# EAGLE schematic Re.Cycle (EAGLE 5.11)

## Sheet 1 of 4
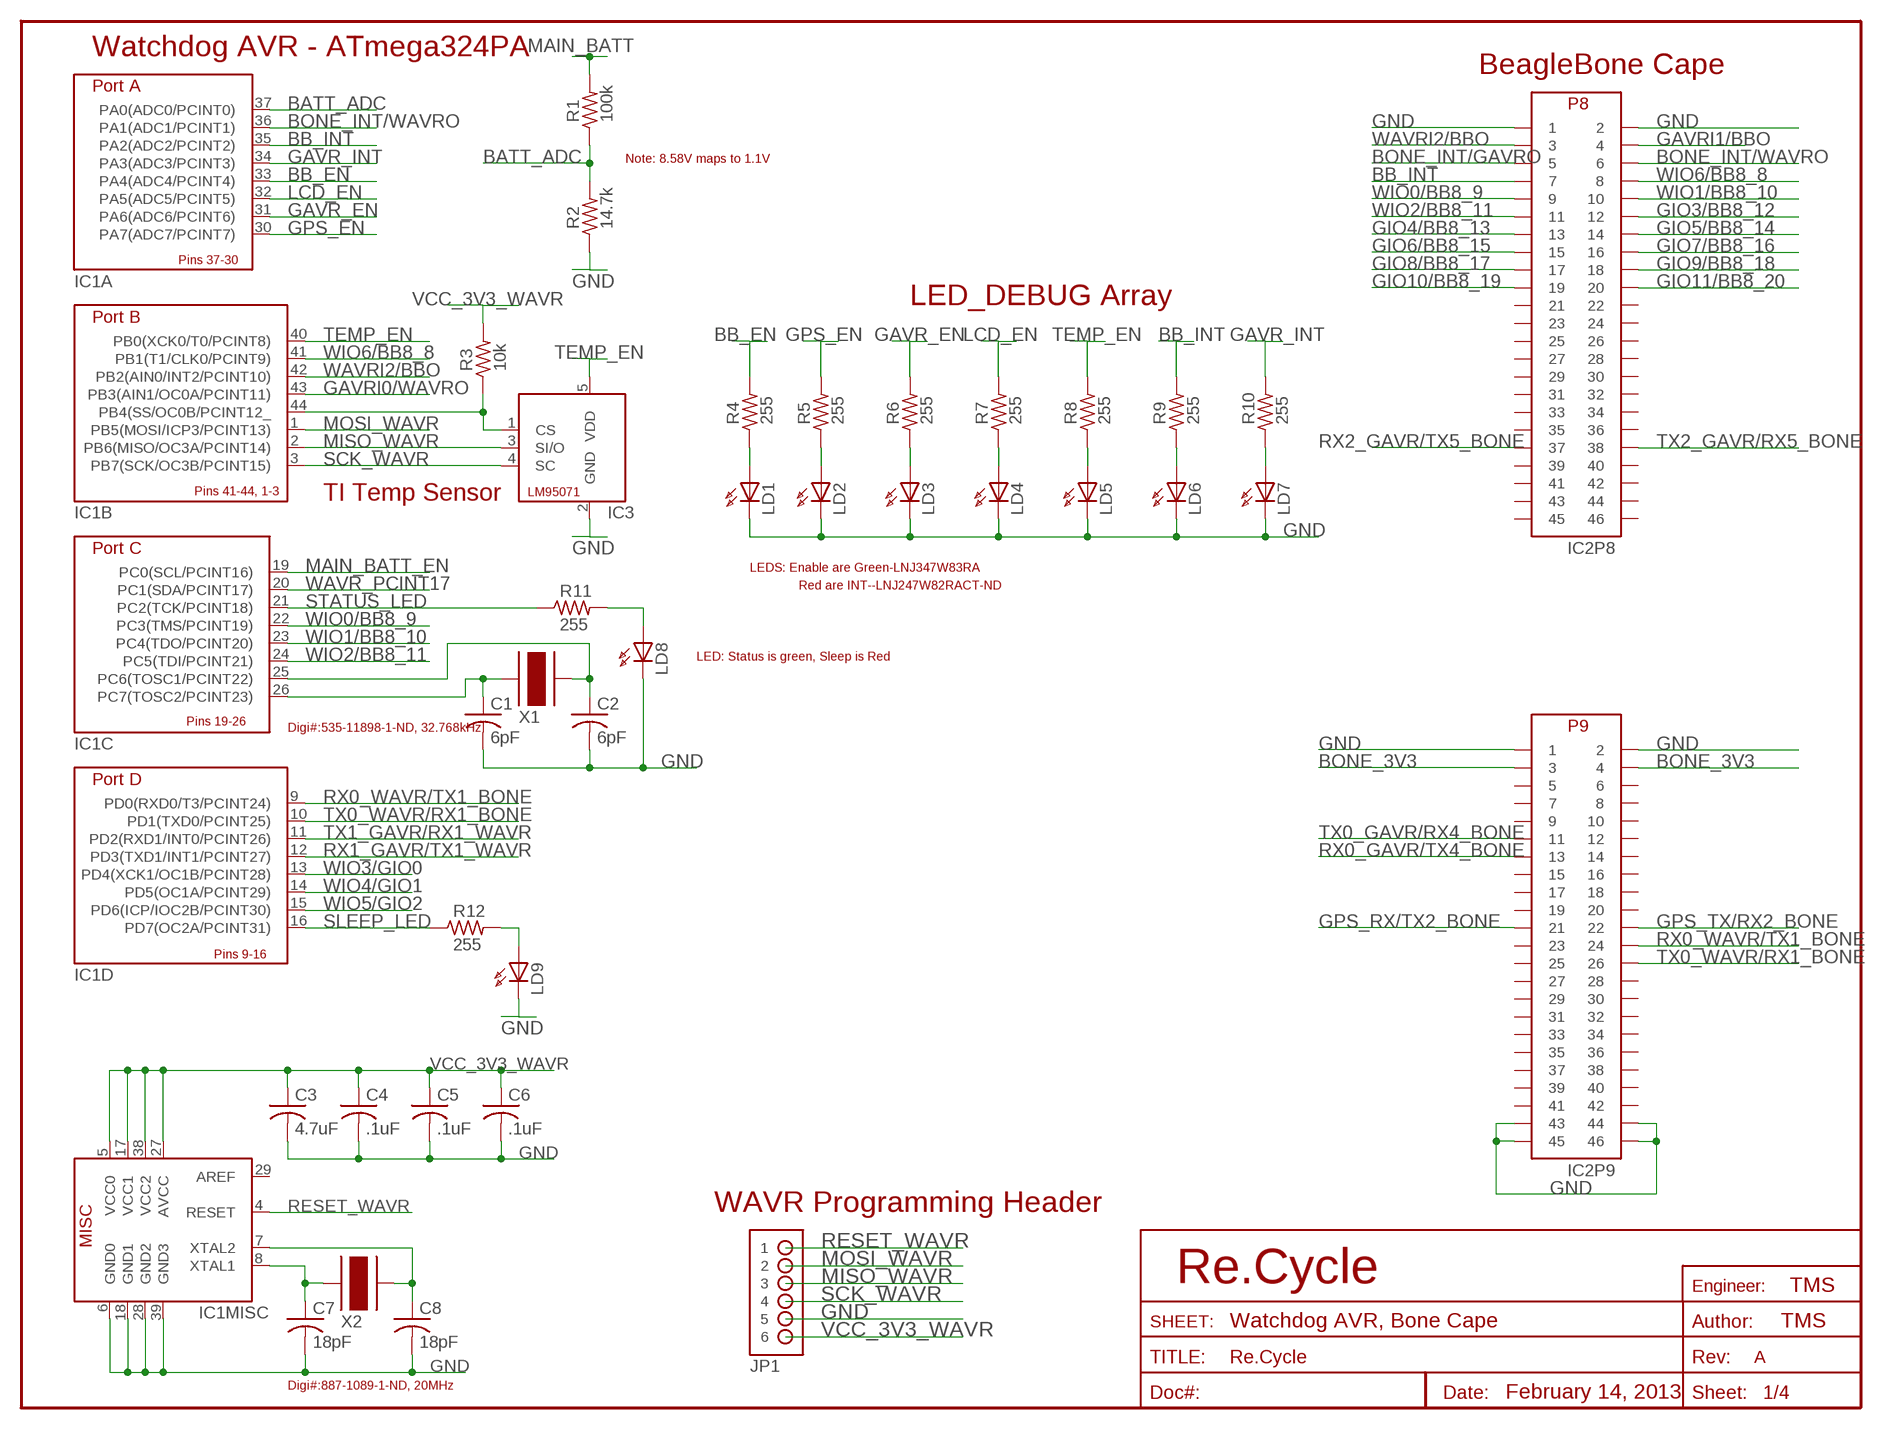
[diagram p0: schematic, sheet 1]

### Parts
C1  6pF  CAP-S0603  [C0603]
C2  6pF  CAP-S0603  [C0603]
C3  4.7uF  CAP-S0603  [C0603]
C4  .1uF  CAP-S0603  [C0603]
C5  .1uF  CAP-S0603  [C0603]
C6  .1uF  CAP-S0603  [C0603]
C7  18pF  CAP-S0603  [C0603]
C8  18pF  CAP-S0603  [C0603]
IC1  ATMEGA1284P-AU  [TQFP44]
IC2  BEAGLE_BONE_CAPE-HEADER_ONLY  [BEAGLE_BONE_CAPE]
IC3  LM95071  [SOT23-5]
JP1  HDR-1X6-OFFSET  [HDR-1X6_OFFSET]
LD1  LED-S0402  [D0402]
LD2  LED-S0402  [D0402]
LD3  LED-S0402  [D0402]
LD4  LED-S0402  [D0402]
LD5  LED-S0402  [D0402]
LD6  LED-S0402  [D0402]
LD7  LED-S0402  [D0402]
LD8  LED-S0402  [D0402]
LD9  LED-S0402  [D0402]
R1  100k  RES-S0603  [R0603]
R2  14.7k  RES-S0603  [R0603]
R3  10k  RES-S0603  [R0603]
R4  255  RES-S0603  [R0603]
R5  255  RES-S0603  [R0603]
R6  255  RES-S0603  [R0603]
R7  255  RES-S0603  [R0603]
R8  255  RES-S0603  [R0603]
R9  255  RES-S0603  [R0603]
R10  255  RES-S0603  [R0603]
R11  255  RES-S0603  [R0603]
R12  255  RES-S0603  [R0603]
X1  XTAL-ABS07  [ABS07]
X2  XTAL-TXC-7A  [TXC-7A-SERIES]

### Nets
BATT_ADC: IC1.37(A:PA0(ADC0/PCINT0)) R1.1 R2.2
BB_EN: IC1.33(A:PA4(ADC4/PCINT4)) R4.2 ; also sheet 3
BB_INT: IC1.35(A:PA2(ADC2/PCINT2)) IC2.P8_7 R9.2
BONE_3V3: IC2.P9_3 IC2.P9_4 ; also sheet 3
BONE_INT/GAVRO: IC2.P8_5 ; also sheet 2
BONE_INT/WAVRO: IC1.36(A:PA1(ADC1/PCINT1)) IC2.P8_6
GAVR_EN: IC1.31(A:PA6(ADC6/PCINT6)) R6.2 ; also sheet 3
GAVR_INT: IC1.34(A:PA3(ADC3/PCINT3)) R10.2 ; also sheet 2
GAVRI0/WAVRO: IC1.43(B:PB3(AIN1/OC0A/PCINT11)) ; also sheet 2
GAVRI1/BBO: IC2.P8_4 ; also sheet 2
GIO3/BB8_12: IC2.P8_12 ; also sheet 2
GIO4/BB8_13: IC2.P8_13 ; also sheet 2
GIO5/BB8_14: IC2.P8_14 ; also sheet 2
GIO6/BB8_15: IC2.P8_15 ; also sheet 2
GIO7/BB8_16: IC2.P8_16 ; also sheet 2
GIO8/BB8_17: IC2.P8_17 ; also sheet 2
GIO9/BB8_18: IC2.P8_18 ; also sheet 2
GIO10/BB8_19: IC2.P8_19 ; also sheet 2
GIO11/BB8_20: IC2.P8_20 ; also sheet 2
GND: C1.2 C2.2 C3.2 C4.2 C5.2 C6.2 C7.2 C8.2 IC1.6(MISC:GND0) IC1.18(MISC:GND1) IC1.28(MISC:GND2) IC1.39(MISC:GND3) IC2.P8_1 IC2.P8_2 IC2.P9_1 IC2.P9_2 IC2.P9_43 IC2.P9_44 IC2.P9_45 IC2.P9_46 IC3.2(GND) JP1.5 LD1.C LD2.C LD3.C LD4.C LD5.C LD6.C LD7.C LD8.C LD9.C R2.1 ; also sheet 2,3,4
GPS_EN: IC1.30(A:PA7(ADC7/PCINT7)) R5.2 ; also sheet 3
GPS_RX/TX2_BONE: IC2.P9_21 ; also sheet 2,3
GPS_TX/RX2_BONE: IC2.P9_22 ; also sheet 2,3
LCD_EN: IC1.32(A:PA5(ADC5/PCINT5)) R7.2 ; also sheet 3
MAIN_BATT: R1.2 ; also sheet 3,4
MAIN_BATT_EN: IC1.19(C:PC0(SCL/PCINT16)) ; also sheet 3
MISO_WAVR: IC1.2(B:PB6(MISO/OC3A/PCINT14)) IC3.3(SI/O) JP1.3
MOSI_WAVR: IC1.1(B:PB5(MOSI/ICP3/PCINT13)) JP1.2
N$1: C2.1 IC1.25(C:PC6(TOSC1/PCINT22)) X1.2
N$2: C8.1 IC1.7(MISC:XTAL2) X2.P$2
N$3: C7.1 IC1.8(MISC:XTAL1) X2.P$1
N$4: IC1.44(B:PB4(SS/OC0B/PCINT12_) IC3.1(CS) R3.1
N$6: LD8.A R11.2
N$8: LD9.A R12.2
N$11: LD1.A R4.1
N$12: LD5.A R8.1
N$13: LD6.A R9.1
N$15: LD7.A R10.1
N$16: LD2.A R5.1
N$17: LD3.A R6.1
N$18: LD4.A R7.1
N$19: C1.1 IC1.26(C:PC7(TOSC2/PCINT23)) X1.1
RESET_WAVR: IC1.4(MISC:RESET) JP1.1
RX0_GAVR/TX4_BONE: IC2.P9_13 ; also sheet 2
RX0_WAVR/TX1_BONE: IC1.9(D:PD0(RXD0/T3/PCINT24)) IC2.P9_24
RX1_GAVR/TX1_WAVR: IC1.12(D:PD3(TXD1/INT1/PCINT27)) ; also sheet 2
RX2_GAVR/TX5_BONE: IC2.P8_37 ; also sheet 2
SCK_WAVR: IC1.3(B:PB7(SCK/OC3B/PCINT15)) IC3.4(SC) JP1.4
SLEEP_LED: IC1.16(D:PD7(OC2A/PCINT31)) R12.1
STATUS_LED: IC1.21(C:PC2(TCK/PCINT18)) R11.1
TEMP_EN: IC1.40(B:PB0(XCK0/T0/PCINT8)) IC3.5(VDD) R8.2
TX0_GAVR/RX4_BONE: IC2.P9_11 ; also sheet 2
TX0_WAVR/RX1_BONE: IC1.10(D:PD1(TXD0/PCINT25)) IC2.P9_26
TX1_GAVR/RX1_WAVR: IC1.11(D:PD2(RXD1/INT0/PCINT26)) ; also sheet 2
TX2_GAVR/RX5_BONE: IC2.P8_38 ; also sheet 2
VCC_3V3_WAVR: C3.1 C4.1 C5.1 C6.1 IC1.5(MISC:VCC0) IC1.17(MISC:VCC1) IC1.27(MISC:AVCC) IC1.38(MISC:VCC2) JP1.6 R3.2 ; also sheet 3
WAVR_PCINT17: IC1.20(C:PC1(SDA/PCINT17)) ; also sheet 2
WAVRI2/BBO: IC1.42(B:PB2(AIN0/INT2/PCINT10)) IC2.P8_3
WIO0/BB8_9: IC1.22(C:PC3(TMS/PCINT19)) IC2.P8_9
WIO1/BB8_10: IC1.23(C:PC4(TDO/PCINT20)) IC2.P8_10
WIO2/BB8_11: IC1.24(C:PC5(TDI/PCINT21)) IC2.P8_11
WIO3/GIO0: IC1.13(D:PD4(XCK1/OC1B/PCINT28)) ; also sheet 2
WIO4/GIO1: IC1.14(D:PD5(OC1A/PCINT29)) ; also sheet 2
WIO5/GIO2: IC1.15(D:PD6(ICP/IOC2B/PCINT30)) ; also sheet 2
WIO6/BB8_8: IC1.41(B:PB1(T1/CLK0/PCINT9)) IC2.P8_8
Unconnected: IC1.29(MISC:AREF) IC2.P8_21 IC2.P8_22 IC2.P8_23 IC2.P8_24 IC2.P8_25 IC2.P8_26 IC2.P8_27 IC2.P8_28 IC2.P8_29 IC2.P8_30 IC2.P8_31 IC2.P8_32 IC2.P8_33 IC2.P8_34 IC2.P8_35 IC2.P8_36 IC2.P8_39 IC2.P8_40 IC2.P8_41 IC2.P8_42 IC2.P8_43 IC2.P8_44 IC2.P8_45 IC2.P8_46 IC2.P9_5 IC2.P9_6 IC2.P9_7 IC2.P9_8 IC2.P9_9 IC2.P9_10 IC2.P9_12 IC2.P9_14 IC2.P9_15 IC2.P9_16 IC2.P9_17 IC2.P9_18 IC2.P9_19 IC2.P9_20 IC2.P9_23 IC2.P9_25 IC2.P9_27 IC2.P9_28 IC2.P9_29 IC2.P9_30 IC2.P9_31 IC2.P9_32 IC2.P9_33 IC2.P9_34 IC2.P9_35 IC2.P9_36 IC2.P9_37 IC2.P9_38 IC2.P9_39 IC2.P9_40 IC2.P9_41 IC2.P9_42

### Notes on the sheet
- Watchdog AVR - ATmega324PA
- BeagleBone Cape
- Note: 8.58V maps to 1.1V
- LED_DEBUG Array
- TI Temp Sensor
- LEDS: Enable are Green-LNJ347W83RA
- Red are INT--LNJ247W82RACT-ND
- LED: Status is green, Sleep is Red
- Digi#:535-11898-1-ND, 32.768kHz
- WAVR Programming Header
- Re.Cycle
- TMS
- Watchdog AVR, Bone Cape | TMS
- A
- Digi#:887-1089-1-ND, 20MHz
- February 14, 2013

## Sheet 2 of 4
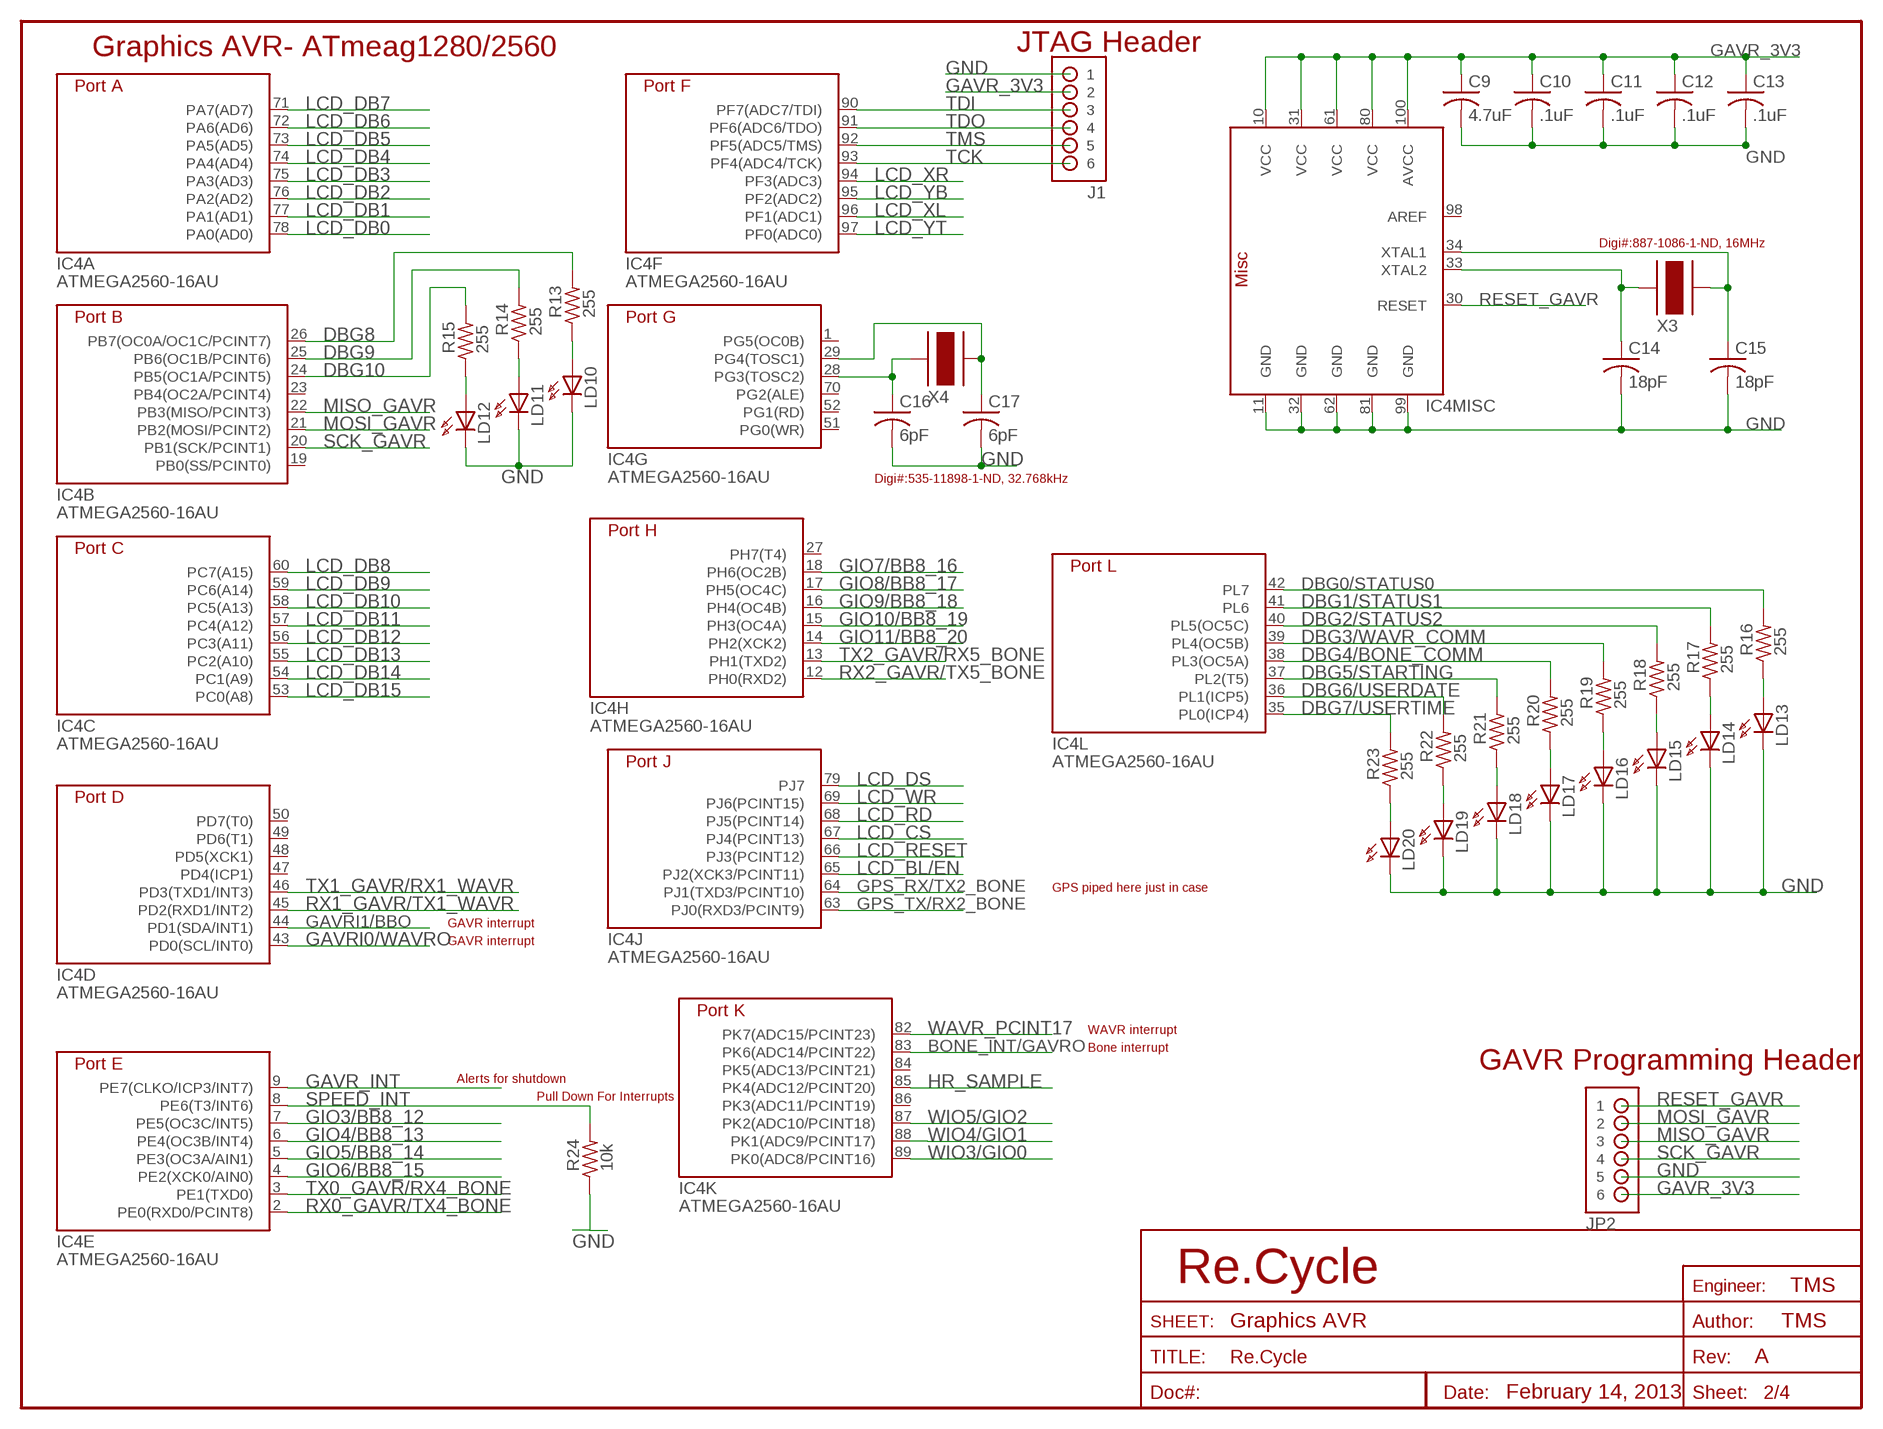
[diagram p1: schematic, sheet 2]

### Parts
C9  4.7uF  CAP-S0603  [C0603]
C10  .1uF  CAP-S0603  [C0603]
C11  .1uF  CAP-S0603  [C0603]
C12  .1uF  CAP-S0603  [C0603]
C13  .1uF  CAP-S0603  [C0603]
C14  18pF  CAP-S0603  [C0603]
C15  18pF  CAP-S0603  [C0603]
C16  6pF  CAP-S0603  [C0603]
C17  6pF  CAP-S0603  [C0603]
IC4  ATMEGA2560-16AU  [TQFP100-100A]
J1  HDR-1X6  [HDR-1X6]
JP2  HDR-1X6-OFFSET  [HDR-1X6_OFFSET]
LD10  LED-S0402  [D0402]
LD11  LED-S0402  [D0402]
LD12  LED-S0402  [D0402]
LD13  LED-S0402  [D0402]
LD14  LED-S0402  [D0402]
LD15  LED-S0402  [D0402]
LD16  LED-S0402  [D0402]
LD17  LED-S0402  [D0402]
LD18  LED-S0402  [D0402]
LD19  LED-S0402  [D0402]
LD20  LED-S0402  [D0402]
R13  255  RES-S0603  [R0603]
R14  255  RES-S0603  [R0603]
R15  255  RES-S0603  [R0603]
R16  255  RES-S0603  [R0603]
R17  255  RES-S0603  [R0603]
R18  255  RES-S0603  [R0603]
R19  255  RES-S0603  [R0603]
R20  255  RES-S0603  [R0603]
R21  255  RES-S0603  [R0603]
R22  255  RES-S0603  [R0603]
R23  255  RES-S0603  [R0603]
R24  10k  RES-S0603  [R0603]
X3  XTAL-TXC-7A  [TXC-7A-SERIES]
X4  XTAL-ABS07  [ABS07]

### Nets
BONE_INT/GAVRO: IC4.83(K:PK6(ADC14/PCINT22)) ; also sheet 1
DBG0/STATUS0: IC4.42(L:PL7) R16.2
DBG1/STATUS1: IC4.41(L:PL6) R17.2
DBG2/STATUS2: IC4.40(L:PL5(OC5C)) R18.2
DBG3/WAVR_COMM: IC4.39(L:PL4(OC5B)) R19.2
DBG4/BONE_COMM: IC4.38(L:PL3(OC5A)) R20.2
DBG5/STARTING: IC4.37(L:PL2(T5)) R21.2
DBG6/USERDATE: IC4.36(L:PL1(ICP5)) R22.2
DBG7/USERTIME: IC4.35(L:PL0(ICP4)) R23.2
DBG8: IC4.26(B:PB7(OC0A/OC1C/PCINT7)) R13.2
DBG9: IC4.25(B:PB6(OC1B/PCINT6)) R14.2
DBG10: IC4.24(B:PB5(OC1A/PCINT5)) R15.2
GAVR_3V3: C9.1 C10.1 C11.1 C12.1 C13.1 IC4.10(MISC:VCC) IC4.31(MISC:VCC) IC4.61(MISC:VCC) IC4.80(MISC:VCC) IC4.100(MISC:AVCC) J1.2 JP2.6 ; also sheet 3
GAVR_INT: IC4.9(E:PE7(CLKO/ICP3/INT7)) ; also sheet 1
GAVRI0/WAVRO: IC4.43(D:PD0(SCL/INT0)) ; also sheet 1
GAVRI1/BBO: IC4.44(D:PD1(SDA/INT1)) ; also sheet 1
GIO3/BB8_12: IC4.7(E:PE5(OC3C/INT5)) ; also sheet 1
GIO4/BB8_13: IC4.6(E:PE4(OC3B/INT4)) ; also sheet 1
GIO5/BB8_14: IC4.5(E:PE3(OC3A/AIN1)) ; also sheet 1
GIO6/BB8_15: IC4.4(E:PE2(XCK0/AIN0)) ; also sheet 1
GIO7/BB8_16: IC4.18(H:PH6(OC2B)) ; also sheet 1
GIO8/BB8_17: IC4.17(H:PH5(OC4C)) ; also sheet 1
GIO9/BB8_18: IC4.16(H:PH4(OC4B)) ; also sheet 1
GIO10/BB8_19: IC4.15(H:PH3(OC4A)) ; also sheet 1
GIO11/BB8_20: IC4.14(H:PH2(XCK2)) ; also sheet 1
GND: C9.2 C10.2 C11.2 C12.2 C13.2 C14.2 C15.2 C16.2 C17.2 IC4.11(MISC:GND) IC4.32(MISC:GND) IC4.62(MISC:GND) IC4.81(MISC:GND) IC4.99(MISC:GND) J1.1 JP2.5 LD10.C LD11.C LD12.C LD13.C LD14.C LD15.C LD16.C LD17.C LD18.C LD19.C LD20.C R24.1 ; also sheet 1,3,4
GPS_RX/TX2_BONE: IC4.64(J:PJ1(TXD3/PCINT10)) ; also sheet 1,3
GPS_TX/RX2_BONE: IC4.63(J:PJ0(RXD3/PCINT9)) ; also sheet 1,3
HR_SAMPLE: IC4.85(K:PK4(ADC12/PCINT20)) ; also sheet 3
LCD_BL/EN: IC4.65(J:PJ2(XCK3/PCINT11)) ; also sheet 3
LCD_CS: IC4.67(J:PJ4(PCINT13)) ; also sheet 3
LCD_DB0: IC4.78(A:PA0(AD0)) ; also sheet 3
LCD_DB1: IC4.77(A:PA1(AD1)) ; also sheet 3
LCD_DB2: IC4.76(A:PA2(AD2)) ; also sheet 3
LCD_DB3: IC4.75(A:PA3(AD3)) ; also sheet 3
LCD_DB4: IC4.74(A:PA4(AD4)) ; also sheet 3
LCD_DB5: IC4.73(A:PA5(AD5)) ; also sheet 3
LCD_DB6: IC4.72(A:PA6(AD6)) ; also sheet 3
LCD_DB7: IC4.71(A:PA7(AD7)) ; also sheet 3
LCD_DB8: IC4.60(C:PC7(A15)) ; also sheet 3
LCD_DB9: IC4.59(C:PC6(A14)) ; also sheet 3
LCD_DB10: IC4.58(C:PC5(A13)) ; also sheet 3
LCD_DB11: IC4.57(C:PC4(A12)) ; also sheet 3
LCD_DB12: IC4.56(C:PC3(A11)) ; also sheet 3
LCD_DB13: IC4.55(C:PC2(A10)) ; also sheet 3
LCD_DB14: IC4.54(C:PC1(A9)) ; also sheet 3
LCD_DB15: IC4.53(C:PC0(A8)) ; also sheet 3
LCD_DS: IC4.79(J:PJ7) ; also sheet 3
LCD_RD: IC4.68(J:PJ5(PCINT14)) ; also sheet 3
LCD_RESET: IC4.66(J:PJ3(PCINT12)) ; also sheet 3
LCD_WR: IC4.69(J:PJ6(PCINT15)) ; also sheet 3
LCD_XL: IC4.96(F:PF1(ADC1)) ; also sheet 3
LCD_XR: IC4.94(F:PF3(ADC3)) ; also sheet 3
LCD_YB: IC4.95(F:PF2(ADC2)) ; also sheet 3
LCD_YT: IC4.97(F:PF0(ADC0)) ; also sheet 3
MISO_GAVR: IC4.22(B:PB3(MISO/PCINT3)) JP2.3
MOSI_GAVR: IC4.21(B:PB2(MOSI/PCINT2)) JP2.2
N$5: C16.1 IC4.28(G:PG3(TOSC2)) X4.1
N$10: C17.1 IC4.29(G:PG4(TOSC1)) X4.2
N$21: C15.1 IC4.34(MISC:XTAL1) X3.P$2
N$22: C14.1 IC4.33(MISC:XTAL2) X3.P$1
N$24: LD14.A R17.1
N$25: LD13.A R16.1
N$26: LD15.A R18.1
N$27: LD10.A R13.1
N$28: LD20.A R23.1
N$29: LD19.A R22.1
N$30: LD18.A R21.1
N$31: LD17.A R20.1
N$32: LD16.A R19.1
N$37: LD12.A R15.1
N$38: LD11.A R14.1
RESET_GAVR: IC4.30(MISC:RESET) JP2.1
RX0_GAVR/TX4_BONE: IC4.2(E:PE0(RXD0/PCINT8)) ; also sheet 1
RX1_GAVR/TX1_WAVR: IC4.45(D:PD2(RXD1/INT2)) ; also sheet 1
RX2_GAVR/TX5_BONE: IC4.12(H:PH0(RXD2)) ; also sheet 1
SCK_GAVR: IC4.20(B:PB1(SCK/PCINT1)) JP2.4
SPEED_INT: IC4.8(E:PE6(T3/INT6)) R24.2 ; also sheet 3
TCK: IC4.93(F:PF4(ADC4/TCK)) J1.6
TDI: IC4.90(F:PF7(ADC7/TDI)) J1.3
TDO: IC4.91(F:PF6(ADC6/TDO)) J1.4
TMS: IC4.92(F:PF5(ADC5/TMS)) J1.5
TX0_GAVR/RX4_BONE: IC4.3(E:PE1(TXD0)) ; also sheet 1
TX1_GAVR/RX1_WAVR: IC4.46(D:PD3(TXD1/INT3)) ; also sheet 1
TX2_GAVR/RX5_BONE: IC4.13(H:PH1(TXD2)) ; also sheet 1
WAVR_PCINT17: IC4.82(K:PK7(ADC15/PCINT23)) ; also sheet 1
WIO3/GIO0: IC4.89(K:PK0(ADC8/PCINT16)) ; also sheet 1
WIO4/GIO1: IC4.88(K:PK1(ADC9/PCINT17)) ; also sheet 1
WIO5/GIO2: IC4.87(K:PK2(ADC10/PCINT18)) ; also sheet 1
Unconnected: IC4.1(G:PG5(OC0B)) IC4.19(B:PB0(SS/PCINT0)) IC4.23(B:PB4(OC2A/PCINT4)) IC4.27(H:PH7(T4)) IC4.47(D:PD4(ICP1)) IC4.48(D:PD5(XCK1)) IC4.49(D:PD6(T1)) IC4.50(D:PD7(T0)) IC4.51(G:PG0(WR)) IC4.52(G:PG1(RD)) IC4.70(G:PG2(ALE)) IC4.84(K:PK5(ADC13/PCINT21)) IC4.86(K:PK3(ADC11/PCINT19)) IC4.98(MISC:AREF)

### Notes on the sheet
- Graphics AVR- ATmeag1280/2560 | JTAG Header
- Digi#:887-1086-1-ND, 16MHz
- Digi#:535-11898-1-ND, 32.768kHz
- GPS piped here just in case
- GAVR interrupt
- GAVR interrupt
- WAVR interrupt
- Bone interrupt
- GAVR Programming Header
- Alerts for shutdown
- Pull Down For Interrupts
- Re.Cycle
- TMS
- Graphics AVR | TMS
- A
- February 14, 2013

## Sheet 3 of 4
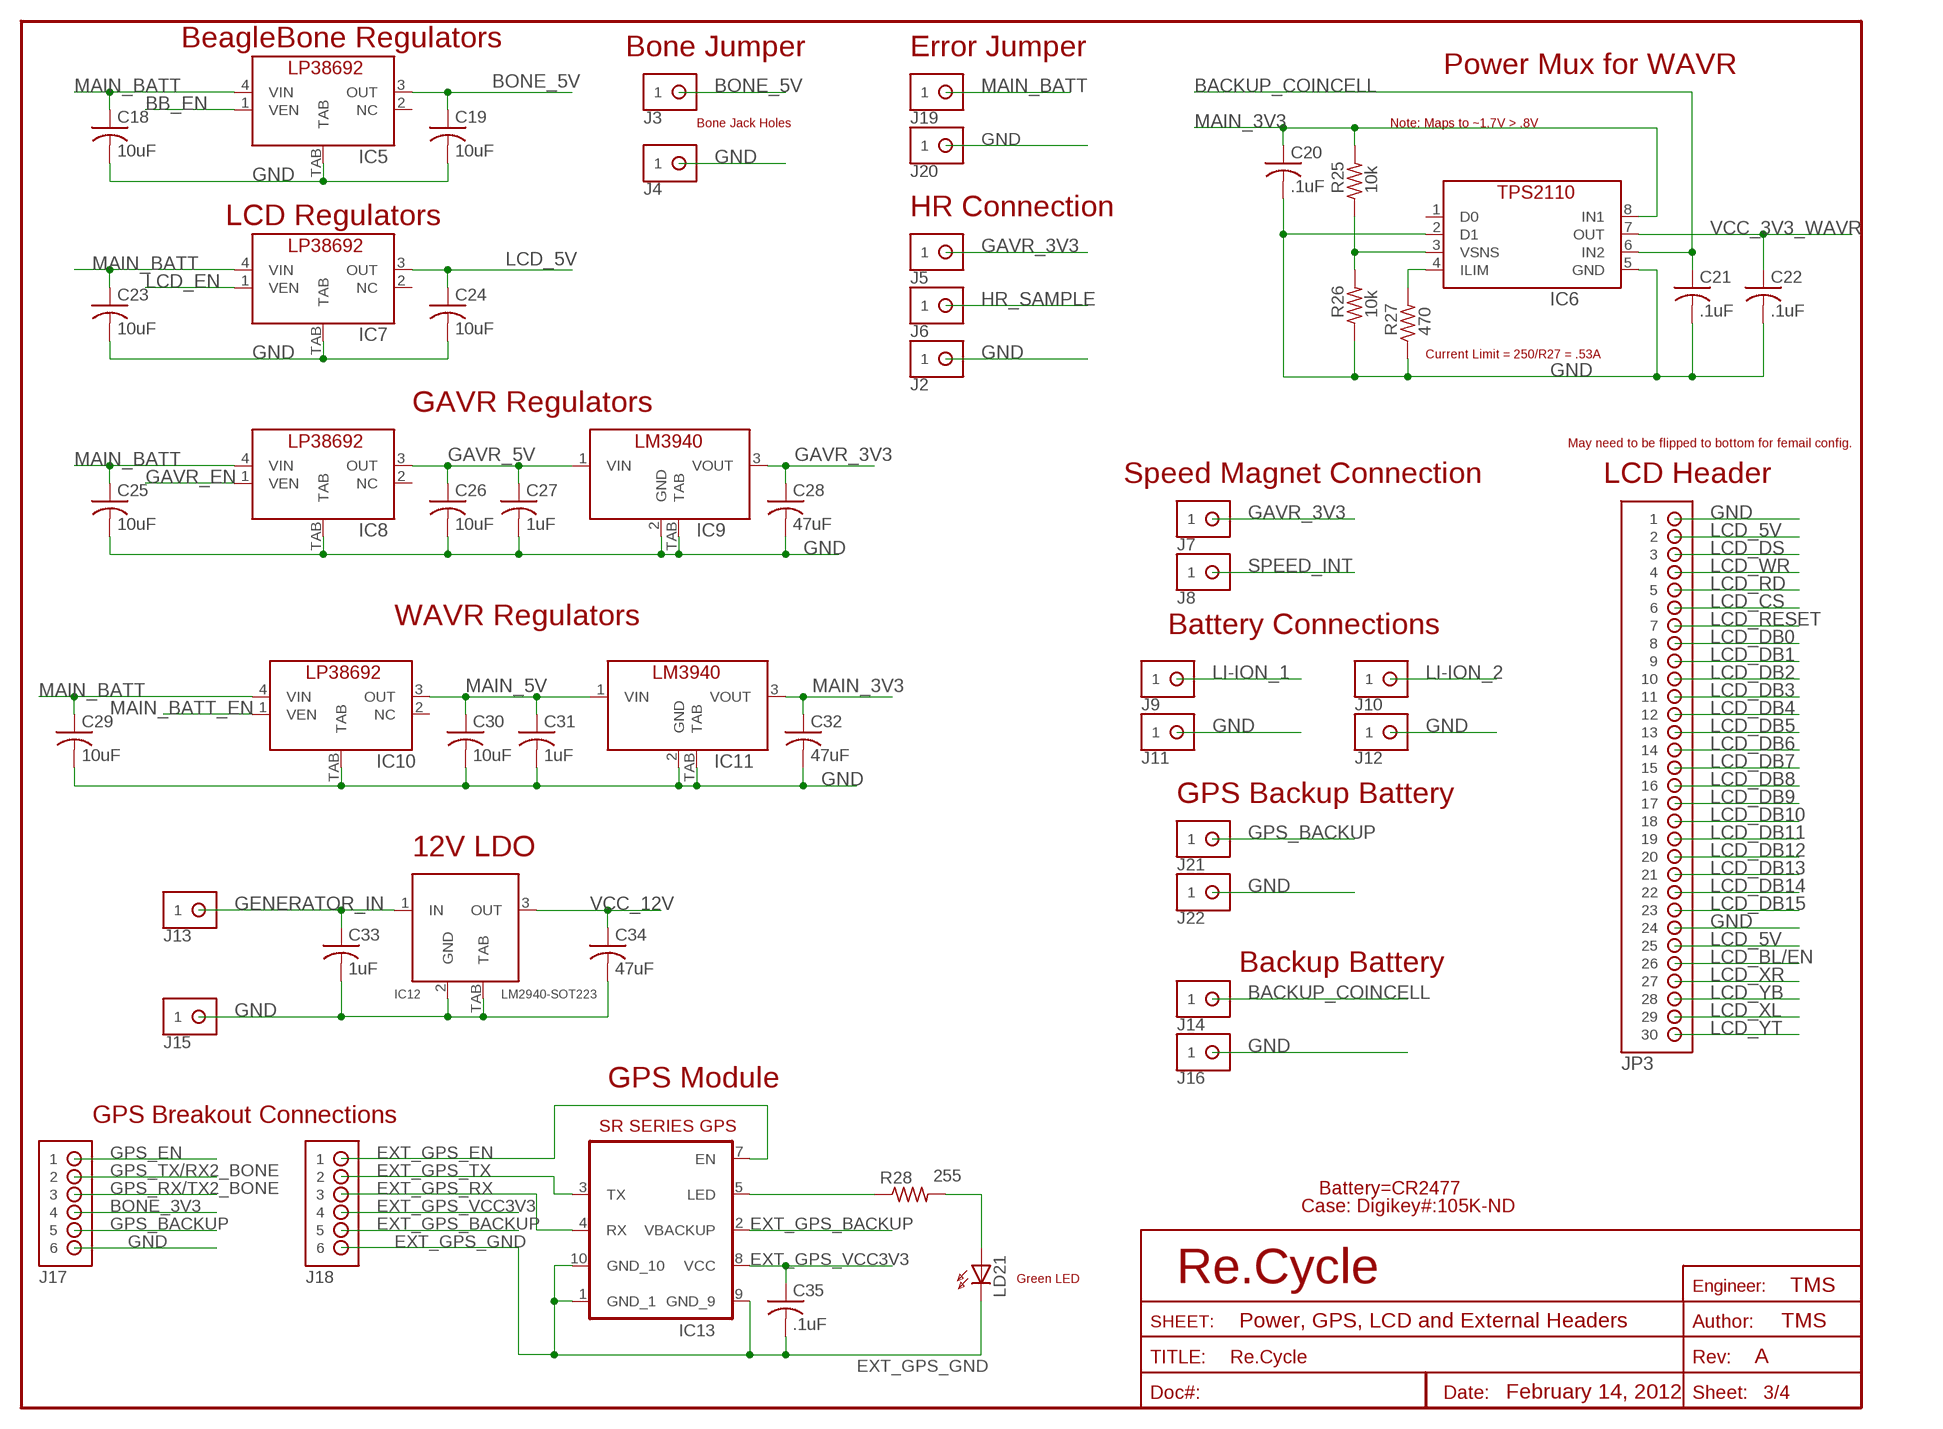
[diagram p2: schematic, sheet 3]

### Parts
C18  10uF  CAP-S0805  [C0805]
C19  10uF  CAP-S0805  [C0805]
C20  .1uF  CAP-S0603  [C0603]
C21  .1uF  CAP-S0603  [C0603]
C22  .1uF  CAP-S0603  [C0603]
C23  10uF  CAP-S0805  [C0805]
C24  10uF  CAP-S0805  [C0805]
C25  10uF  CAP-S0805  [C0805]
C26  10uF  CAP-S0805  [C0805]
C27  1uF  CAP-S0603  [C0603]
C28  47uF  CAP-S1206  [C1206]
C29  10uF  CAP-S0805  [C0805]
C30  10uF  CAP-S0805  [C0805]
C31  1uF  CAP-S0603  [C0603]
C32  47uF  CAP-S1206  [C1206]
C33  1uF  CAP-S0603  [C0603]
C34  47uF  CAP-S1206  [C1206]
C35  .1uF  CAP-S0603  [C0603]
IC5  LP38692  [SOT223-5]
IC6  TPS2110  [TSSOP8]
IC7  LP38692  [SOT223-5]
IC8  LP38692  [SOT223-5]
IC9  LM3940  [SOT223]
IC10  LP38692  [SOT223-5]
IC11  LM3940  [SOT223]
IC12  LM2940-SOT223  [SOT223]
IC13  SR-GPS-SR-GPS  [SR-GPS]
J2  HDR-1X1-18AWG_WIRE  [18AWG-SOLDERPOINT]
J3  HDR-1X1-18AWG_WIRE  [18AWG-SOLDERPOINT]
J4  HDR-1X1-18AWG_WIRE  [18AWG-SOLDERPOINT]
J5  HDR-1X1-18AWG_WIRE  [18AWG-SOLDERPOINT]
J6  HDR-1X1-18AWG_WIRE  [18AWG-SOLDERPOINT]
J7  HDR-1X1-18AWG_WIRE  [18AWG-SOLDERPOINT]
J8  HDR-1X1-18AWG_WIRE  [18AWG-SOLDERPOINT]
J9  HDR-1X1-18AWG_WIRE  [18AWG-SOLDERPOINT]
J10  HDR-1X1-18AWG_WIRE  [18AWG-SOLDERPOINT]
J11  HDR-1X1-18AWG_WIRE  [18AWG-SOLDERPOINT]
J12  HDR-1X1-18AWG_WIRE  [18AWG-SOLDERPOINT]
J13  HDR-1X1-18AWG_WIRE  [18AWG-SOLDERPOINT]
J14  HDR-1X1-18AWG_WIRE  [18AWG-SOLDERPOINT]
J15  HDR-1X1-18AWG_WIRE  [18AWG-SOLDERPOINT]
J16  HDR-1X1-18AWG_WIRE  [18AWG-SOLDERPOINT]
J17  HDR-2X3  [HDR-2X3]
J18  HDR-2X3  [HDR-2X3]
J19  HDR-1X1-18AWG_WIRE  [18AWG-SOLDERPOINT]
J20  HDR-1X1-18AWG_WIRE  [18AWG-SOLDERPOINT]
J21  HDR-1X1-18AWG_WIRE  [18AWG-SOLDERPOINT]
J22  HDR-1X1-18AWG_WIRE  [18AWG-SOLDERPOINT]
JP3  HDR-2X15  [HDR-2X15]
LD21  LED-S0402  [D0402]
R25  10k  RES-S0603  [R0603]
R26  10k  RES-S0603  [R0603]
R27  470  RES-S0402  [R0402]
R28  255  RES-S0603  [R0603]

### Nets
BACKUP_COINCELL: C21.1 IC6.6(IN2) J14.1
BB_EN: IC5.1(VEN) ; also sheet 1
BONE_3V3: J17.4 ; also sheet 1
BONE_5V: C19.1 IC5.3(OUT) J3.1
EXT_GPS_BACKUP: IC13.2(VBACKUP) J18.5
EXT_GPS_EN: IC13.7(EN) J18.1
EXT_GPS_GND: C35.2 IC13.1(GND_1) IC13.9(GND_9) IC13.10(GND_10) J18.6 LD21.C
EXT_GPS_RX: IC13.4(RX) J18.3
EXT_GPS_TX: IC13.3(TX) J18.2
EXT_GPS_VCC3V3: C35.1 IC13.8(VCC) J18.4
GAVR_3V3: C28.1 IC9.3(VOUT) J5.1 J7.1 ; also sheet 2
GAVR_5V: C26.1 C27.1 IC8.3(OUT) IC9.1(VIN)
GAVR_EN: IC8.1(VEN) ; also sheet 1
GENERATOR_IN: C33.1 IC12.1(IN) J13.1
GND: C18.2 C19.2 C20.2 C21.2 C22.2 C23.2 C24.2 C25.2 C26.2 C27.2 C28.2 C29.2 C30.2 C31.2 C32.2 C33.2 C34.2 IC5.TAB IC6.2(D1) IC6.5(GND) IC7.TAB IC8.TAB IC9.2(GND) IC9.TAB IC10.TAB IC11.2(GND) IC11.TAB IC12.2(GND) IC12.TAB J2.1 J4.1 J11.1 J12.1 J15.1 J16.1 J17.6 J20.1 J22.1 JP3.1 JP3.24 R26.1 R27.1 ; also sheet 1,2,4
GPS_BACKUP: J17.5 J21.1
GPS_EN: J17.1 ; also sheet 1
GPS_RX/TX2_BONE: J17.3 ; also sheet 1,2
GPS_TX/RX2_BONE: J17.2 ; also sheet 1,2
HR_SAMPLE: J6.1 ; also sheet 2
LCD_5V: C24.1 IC7.3(OUT) JP3.2 JP3.25
LCD_BL/EN: JP3.26 ; also sheet 2
LCD_CS: JP3.6 ; also sheet 2
LCD_DB0: JP3.8 ; also sheet 2
LCD_DB1: JP3.9 ; also sheet 2
LCD_DB2: JP3.10 ; also sheet 2
LCD_DB3: JP3.11 ; also sheet 2
LCD_DB4: JP3.12 ; also sheet 2
LCD_DB5: JP3.13 ; also sheet 2
LCD_DB6: JP3.14 ; also sheet 2
LCD_DB7: JP3.15 ; also sheet 2
LCD_DB8: JP3.16 ; also sheet 2
LCD_DB9: JP3.17 ; also sheet 2
LCD_DB10: JP3.18 ; also sheet 2
LCD_DB11: JP3.19 ; also sheet 2
LCD_DB12: JP3.20 ; also sheet 2
LCD_DB13: JP3.21 ; also sheet 2
LCD_DB14: JP3.22 ; also sheet 2
LCD_DB15: JP3.23 ; also sheet 2
LCD_DS: JP3.3 ; also sheet 2
LCD_EN: IC7.1(VEN) ; also sheet 1
LCD_RD: JP3.5 ; also sheet 2
LCD_RESET: JP3.7 ; also sheet 2
LCD_WR: JP3.4 ; also sheet 2
LCD_XL: JP3.29 ; also sheet 2
LCD_XR: JP3.27 ; also sheet 2
LCD_YB: JP3.28 ; also sheet 2
LCD_YT: JP3.30 ; also sheet 2
LI-ION_1: J9.1 ; also sheet 4
LI-ION_2: J10.1 ; also sheet 4
MAIN_3V3: C20.1 C32.1 IC6.8(IN1) IC11.3(VOUT) R25.2
MAIN_5V: C30.1 C31.1 IC10.3(OUT) IC11.1(VIN)
MAIN_BATT: C18.1 C23.1 C25.1 C29.1 IC5.4(VIN) IC7.4(VIN) IC8.4(VIN) IC10.4(VIN) J19.1 ; also sheet 1,4
MAIN_BATT_EN: IC10.1(VEN) ; also sheet 1
N$7: IC6.3(VSNS) R25.1 R26.2
N$9: IC6.4(ILIM) R27.2
N$35: IC13.5(LED) R28.1
N$36: LD21.A R28.2
SPEED_INT: J8.1 ; also sheet 2
VCC_3V3_WAVR: C22.1 IC6.7(OUT) ; also sheet 1
VCC_12V: C34.1 IC12.3(OUT) ; also sheet 4
Unconnected: IC5.2(NC) IC6.1(D0) IC7.2(NC) IC8.2(NC) IC10.2(NC)

### Notes on the sheet
- BeagleBone Regulators
- Bone Jumper | Error Jumper
- Power Mux for WAVR
- Bone Jack Holes | Note: Maps to ~1.7V > .8V
- HR Connection
- LCD Regulators
- Current Limit = 250/R27 = .53A
- GAVR Regulators
- May need to be flipped to bottom for femail config.
- Speed Magnet Connection | LCD Header
- WAVR Regulators
- Battery Connections
- GPS Backup Battery
- 12V LDO
- Backup Battery
- GPS Module
- GPS Breakout Connections
- Battery=CR2477
- Case: Digikey#:105K-ND
- Green LED | Re.Cycle
- TMS
- Power, GPS, LCD and External Headers | TMS
- A
- February 14, 2012

## Sheet 4 of 4
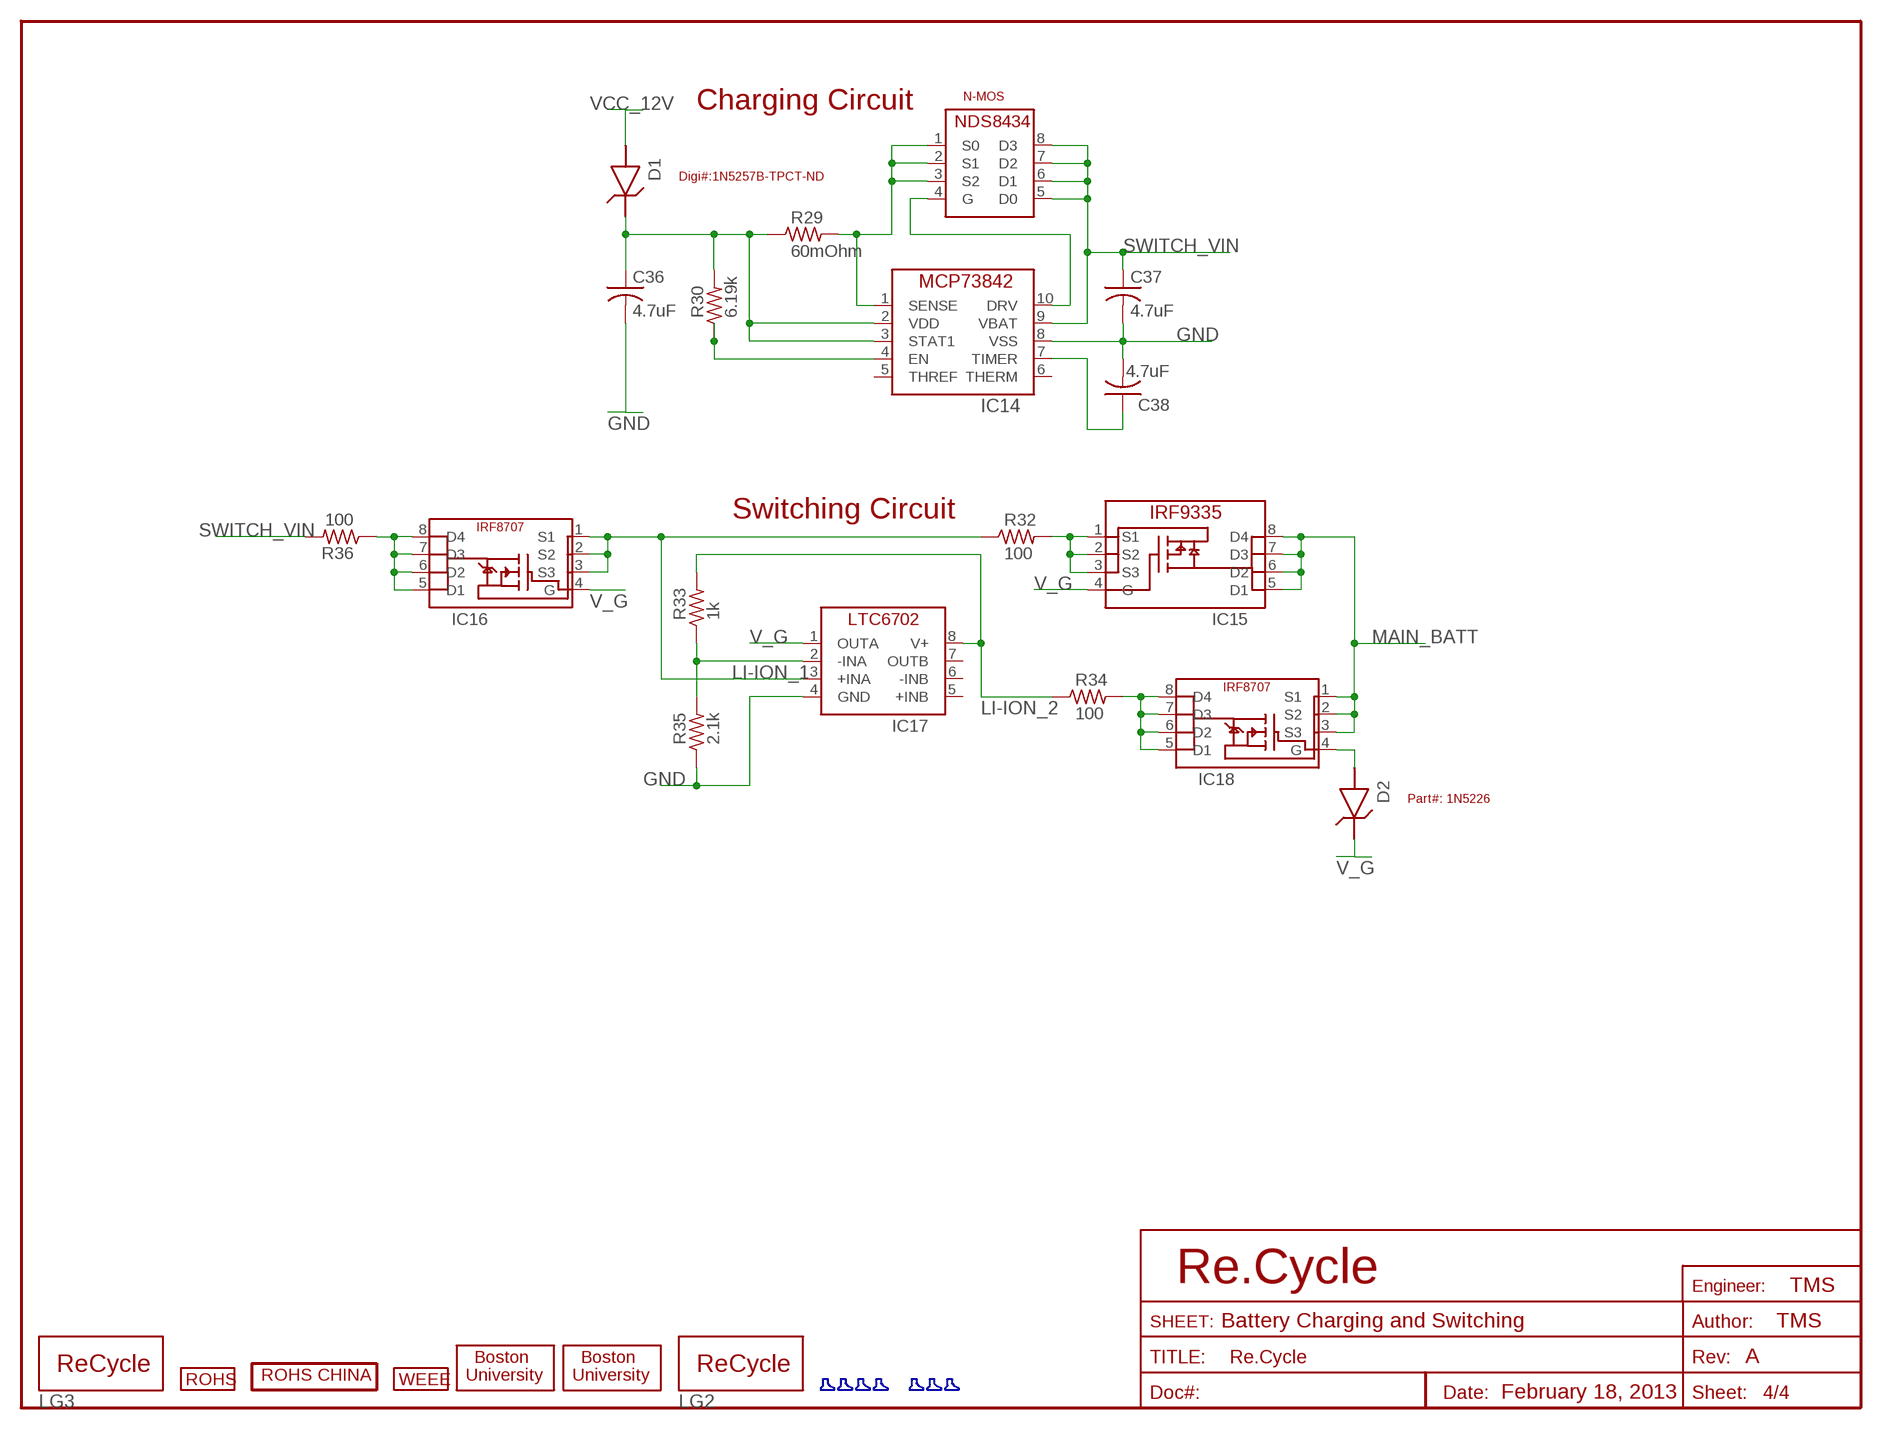
[diagram p3: schematic, sheet 4]

### Parts
C36  4.7uF  CAP-S0603  [C0603]
C37  4.7uF  CAP-S0603  [C0603]
C38  4.7uF  CAP-S0603  [C0603]
D1  ZENER-DO35  [DO35]
D2  ZENER-213AC  [DO-213AC]
F1  FOOT  [FOOT#6]
F2  FOOT  [FOOT#6]
F5  FOOT  [FOOT#6]
F6  FOOT  [FOOT#6]
F7  FOOT  [FOOT#6]
F8  FOOT  [FOOT#6]
F10  FOOT  [FOOT#6]
IC14  MCP73842  [MSOP10-UN]
IC15  IRF9335-SO8  [SO8]
IC16  IRF8707  [SO8]
IC17  LTC6702  [SOT23-8]
IC18  IRF8707  [SO8]
LG2  RECYCLE_LOGO  [RECYCLE_LOGO]
LG3  RECYCLE_LOGO  [RECYCLE_LOGO]
LOGO1  BU_LOGO-CUSTOM_1.5  [BULOGO3_1.5SCALE]
LOGO2  ROHS-CHINA  [ROHS_CHINA_LOGO]
LOGO3  BU_LOGO-CUSTOM_1.5  [BULOGO3_1.5SCALE]
LOGO4  WEEE-S  [WEEE_LOGO]
LOGO?1  ROHS-CHECK-0.4  [ROHS_CHECK_LOGO]
R29  60mOhm  RES-S1206  [R1206]
R30  6.19k  RES-S0603  [R0603]
R32  100  RES-S0603  [R0603]
R33  1k  RES-S0603  [R0603]
R34  100  RES-S0603  [R0603]
R35  2.1k  RES-S0603  [R0603]
R36  100  RES-S0603  [R0603]
T1  NDS8434NDS8434  [SOIC8]

### Nets
DRAIN: IC16.5(D1) IC16.6(D2) IC16.7(D3) IC16.8(D4) R36.1
GND: C36.2 C37.2 C38.2 IC14.8(VSS) IC17.4(GND) R35.1 ; also sheet 1,2,3
LI-ION_1: IC16.1(S1) IC16.2(S2) IC16.3(S3) IC17.3(+INA) R32.1 ; also sheet 3
LI-ION_2: IC17.8(V+) R33.2 R34.1 ; also sheet 3
MAIN_BATT: IC15.5(D1) IC15.6(D2) IC15.7(D3) IC15.8(D4) IC18.1(S1) IC18.2(S2) IC18.3(S3) ; also sheet 1,3
N$14: IC17.2(-INA) R33.1 R35.2
N$20: IC14.1(SENSE) R29.2 T1.1(S0) T1.2(S1) T1.3(S2)
N$33: C36.1 D1.C IC14.2(VDD) IC14.3(STAT1) R29.1 R30.2
N$34: IC14.4(EN) R30.1
N$39: C38.1 IC14.7(TIMER)
N$40: IC14.10(DRV) T1.4(G)
N$43: IC18.5(D1) IC18.6(D2) IC18.7(D3) IC18.8(D4) R34.2
N$44: IC15.1(S1) IC15.2(S2) IC15.3(S3) R32.2
N$49: D2.1(A) IC18.4(G)
SWITCH_VIN: C37.1 IC14.9(VBAT) R36.2 T1.5(D0) T1.6(D1) T1.7(D2) T1.8(D3)
V_G: D2.2(C) IC15.4(G) IC16.4(G) IC17.1(OUTA)
VCC_12V: D1.A ; also sheet 3
Unconnected: IC14.5(THREF) IC14.6(THERM) IC17.5(+INB) IC17.6(-INB) IC17.7(OUTB)

### Notes on the sheet
- N-MOS
- Charging Circuit
- Digi#:1N5257B-TPCT-ND
- Switching Circuit
- Part#: 1N5226
- Re.Cycle
- TMS
- Battery Charging and Switching | TMS
- A
- February 18, 2013

## Library data of the parts
C1-C38 = Discrete:CAP: Capacitor
D1 D2 = Discrete:ZENER: Digi-Key Part Number MAZ243000GCT-ND Manufacturer Panasonic - SSG Manufacturer Part Number MAZ243000G Description DIODE ZENER 43V 1W DO-41
F1 F2 F5-F8 F10 = Mechanical:FOOT: Foot (ie. #6 screw, or Rubber)
IC1 = Atmel:ATMEGA1284P-AU: Atmega1284P-AU, TQFP44 Package, Digikey: ATMEGA1284P-AURCT-ND, 128kb Flash, 3 SPI, 2 USART, 1 I2C
IC2 = Mechanical:BEAGLE_BONE_CAPE
IC3 = TI:LM95071: Texas Instruments Temperature Sensor, Digikey Part Number: LM95071CIMF/NOPBCT-ND
IC4 = Atmel:ATMEGA2560: Atmel ATmega2560, Also ATmega1280 and ATmega640
IC5 IC7 IC8 IC10 = IC:LP38692
IC6 = IC:TPS2110: TI's Power Mux. Switches between two power sources with different applications.
IC9 IC11 = IC:LM3940: TI's 5V->3.3V regulator, capable of outputting 1A
IC12 = IC:LM2940: Voltage regulator, Fixed output, LDO
IC13 = IC:SR-GPS: The SR Series GPS receiver module is a selfcontained high-performance GPS receiver with an on-board antenna, LNA and SAW filter. Based on the SiRFstar III chipset, it provides exceptional sensitivity, even in dense foliage and urban canyons. The module?s very low power consumption helps maximize runtimes in battery powered applications.
IC14 = Microchip:MCP73842
IC15 = IC:IRF9335: Power Mos, 30V at 5.4V, P-MOS. Digikey#:IRF9335TRPBFCT-ND
IC16 IC18 = IC:IRF8707
IC17 = IC:LTC6702
J1 = Mechanical:HDR-1X6
J2-J16 J19-J22 = Mechanical:HDR-1X1
J17 J18 = Mechanical:HDR-2X3
JP1 JP2 = Mechanical:HDR-1X6-OFFSET: 42 mil hole pattern with 16mil offset for jtag connector
JP3 = Mechanical:HDR-2X15
LD1-LD21 = Discrete:LED: Discrete LED
LG2 LG3 = Logo:RECYCLE_LOGO
LOGO1 LOGO3 = Logo:BU_LOGO
LOGO2 = Logo:ROHS-CHINA: Chinese ROHS symbol logo
LOGO4 = Logo:WEEE: WEEE Symbol
LOGO?1 = Logo:ROHS-CHECK: ROHS Graphical Checkmark Logo
R1-R30 R32-R36 = Discrete:RES: Resistor
T1 = Discrete:NDS8434
X1-X4 = Discrete:XTAL: Quartz Crystal